# Altium schematic sheet 05_外部接口与其他部分.SchDoc
size A4
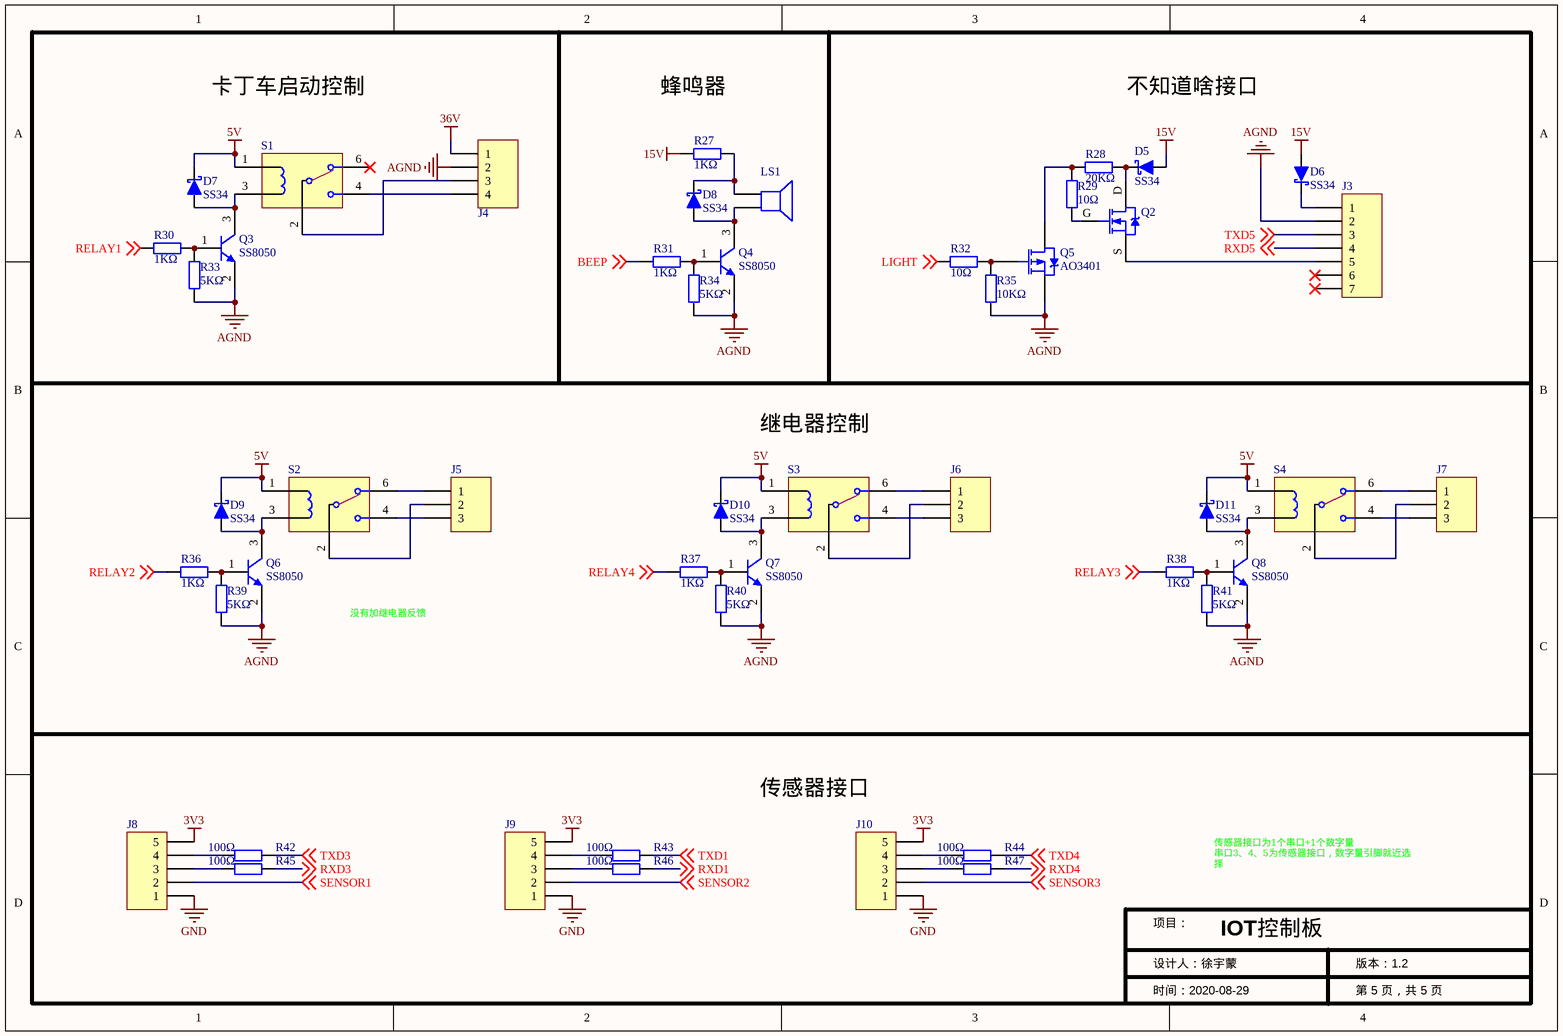
[diagram p0: 05_外部接口与其他部分.SchDoc]

## Parts
D5  SS34  [SMA(DO-214AC)]
D6  SS34  [SMA(DO-214AC)]
D7  SS34  [SMA(DO-214AC)]
D8  SS34  [SMA(DO-214AC)]
D9  SS34  [SMA(DO-214AC)]
D10  SS34  [SMA(DO-214AC)]
D11  SS34  [SMA(DO-214AC)]
J3  Header7  [Header_7X1_XH_2.54_弯针]  (value not drawn)
J4  Header 4  [Header_4P_XH_2.54_弯脚]  (value not drawn)
J5  Header3  [Header_3X1_XH_2.54_弯脚]  (value not drawn)
J6  Header3  [Header_3X1_XH_2.54_弯脚]  (value not drawn)
J7  Header3  [Header_3X1_XH_2.54_弯脚]  (value not drawn)
J8  Header5  [Header_5X1_XH_2.54_弯针]  (value not drawn)
J9  Header5  [Header_5X1_XH_2.54_弯针]  (value not drawn)
J10  Header5  [Header_5X1_XH_2.54_弯针]  (value not drawn)
LS1  蜂鸣器  [蜂鸣器 9*5mm]  (value not drawn)
Q2  AO3400  [SOT-23-MOSFET]  (value not drawn)
Q3  SS8050  [SOT-23]
Q4  SS8050  [SOT-23]
Q5  AO3401  [SOT-23-MOSFET]
Q6  SS8050  [SOT-23]
Q7  SS8050  [SOT-23]
Q8  SS8050  [SOT-23]
R27  value 1KΩ  [0603]  (hidden comment: Res)
R28  value 20KΩ  [0603]  (hidden comment: Res)
R29  value 10Ω  [0603]  (hidden comment: Res)
R30  value 1KΩ  [0603]  (hidden comment: Res)
R31  value 1KΩ  [0603]  (hidden comment: Res)
R32  value 10Ω  [0603]  (hidden comment: Res)
R33  value 5KΩ  [0603]  (hidden comment: Res)
R34  value 5KΩ  [0603]  (hidden comment: Res)
R35  value 10KΩ  [0603]  (hidden comment: Res)
R36  value 1KΩ  [0603]  (hidden comment: Res)
R37  value 1KΩ  [0603]  (hidden comment: Res)
R38  value 1KΩ  [0603]  (hidden comment: Res)
R39  value 5KΩ  [0603]  (hidden comment: Res)
R40  value 5KΩ  [0603]  (hidden comment: Res)
R41  value 5KΩ  [0603]  (hidden comment: Res)
R42  value 100Ω  [0603]  (hidden comment: Res)
R43  value 100Ω  [0603]  (hidden comment: Res)
R44  value 100Ω  [0603]  (hidden comment: Res)
R45  value 100Ω  [0603]  (hidden comment: Res)
R46  value 100Ω  [0603]  (hidden comment: Res)
R47  value 100Ω  [0603]  (hidden comment: Res)
S1  Delay  [SongLe_Relay]  (value not drawn)
S2  Delay  [SongLe_Relay]  (value not drawn)
S3  Delay  [SongLe_Relay]  (value not drawn)
S4  Delay  [SongLe_Relay]  (value not drawn)

## Nets
3V3: J8.5 J9.5 J10.5
5V: D7.2(K) D9.2(K) D10.2(K) D11.2(K) S1.1 S2.1 S3.1 S4.1
15V: D5.1(A) D6.1(A) R27.2
36V: J4.1
AGND: J3.2 J4.2 Q3.2(E) Q4.2(E) Q5.S Q6.2(E) Q7.2(E) Q8.2(E) R33.1 R34.1 R35.1 R39.1 R40.1 R41.1
GND: J8.1 J9.1 J10.1
BEEP: R31.2 ; off-sheet BEEP
LIGHT: R32.2 ; off-sheet LIGHT
RELAY1: R30.2 ; off-sheet RELAY1
RELAY2: R36.2 ; off-sheet RELAY2
RELAY3: R38.2 ; off-sheet RELAY3
RELAY4: R37.2 ; off-sheet RELAY4
RXD1: R46.2 ; off-sheet RXD1
RXD3: R45.2 ; off-sheet RXD3
RXD4: R47.2 ; off-sheet RXD4
RXD5: J3.4 ; off-sheet RXD5
SENSOR1: J8.2 ; off-sheet SENSOR1
SENSOR2: J9.2 ; off-sheet SENSOR2
SENSOR3: J10.2 ; off-sheet SENSOR3
TXD1: R43.2 ; off-sheet TXD1
TXD3: R42.2 ; off-sheet TXD3
TXD4: R44.2 ; off-sheet TXD4
TXD5: J3.3 ; off-sheet TXD5
NetD5_2: D5.2(K) Q2.D R28.1
NetD6_2: D6.2(K) J3.1
NetD7_1: D7.1(A) Q3.3(C) S1.3
NetD8_1: D8.1(A) LS1.2 Q4.3(C)
NetD8_2: D8.2(K) LS1.1 R27.1
NetD9_1: D9.1(A) Q6.3(C) S2.3
NetD10_1: D10.1(A) Q7.3(C) S3.3
NetD11_1: D11.1(A) Q8.3(C) S4.3
NetJ3_5: J3.5 Q2.S
NetJ4_3: J4.3 S1.2
NetJ4_4: J4.4 S1.4
NetJ5_1: J5.1 S2.6
NetJ5_2: J5.2 S2.2
NetJ5_3: J5.3 S2.4
NetJ6_1: J6.1 S3.6
NetJ6_2: J6.2 S3.2
NetJ6_3: J6.3 S3.4
NetJ7_1: J7.1 S4.6
NetJ7_2: J7.2 S4.2
NetJ7_3: J7.3 S4.4
NetJ8_3: J8.3 R45.1
NetJ8_4: J8.4 R42.1
NetJ9_3: J9.3 R46.1
NetJ9_4: J9.4 R43.1
NetJ10_3: J10.3 R47.1
NetJ10_4: J10.4 R44.1
NetQ2_G: Q2.G R29.2
NetQ3_1: Q3.1(B) R30.1 R33.2
NetQ4_1: Q4.1(B) R31.1 R34.2
NetQ5_D: Q5.D R28.2 R29.1
NetQ5_G: Q5.G R32.1 R35.2
NetQ6_1: Q6.1(B) R36.1 R39.2
NetQ7_1: Q7.1(B) R37.1 R40.2
NetQ8_1: Q8.1(B) R38.1 R41.2

Not connected (* = marked no-connect by the designer): J3 6* 7*; S1 6*

## Notes on the sheet
- 卡丁车启动控制
- 蜂鸣器
- 不知道啥接口
- 继电器控制
- 没有加继电器反馈
- 传感器接口
- 项目：
- 传感器接口为1个串口+1个数字量
  串口3、4、5为传感器接口，数字量引脚就近选择
- IOT控制板
- 设计人：徐宇蒙
- 时间：2020-08-29
- 第 5 页，共 5 页
- 版本：1.2

## Library data of the parts
D5-D11 = D Schottky: Schottky Diode; Published: 8-Jun-2000; LatestRevisionDate: 17-Jul-2002; LatestRevisionNote: Re-released for DXP Platform.; PackageReference: SMB; Publisher: Altium Limited; Code_JEDEC: DO-214-AA
J3 = Header7: 接插件
J4 = Header 4: 接插件; LatestRevisionDate: 17-Jul-2002; LatestRevisionNote: Re-released for DXP Platform.; Publisher: Altium Limited
J5-J7 = Header3: 接插件
J8-J10 = Header5: 接插件
LS1 = Speaker: Loudspeaker; Published: 24-Mar-1999; LatestRevisionDate: 17-Jul-2002; LatestRevisionNote: Re-released for DXP Platform.; Publisher: Altium Limited
Q2 = MOSFET-N: N沟道MOS管
Q3 Q4 Q6-Q8 = SS8050: NPN贴片三极管; Published: 8-Jun-2000; LatestRevisionDate: 15-Jan-2003; LatestRevisionNote: PCB Footprint 'BCY-W3/D4.7' replaced; DatasheetDocument: 1997; PackageDocument: Sep-1998; PackageReference: TO-92A; Publisher: Altium Limited; Code_JEDEC: TO-92A; ComponentLink1Description: Manufacturer Link; ComponentLink1URL: http://www.fairchildsemi.com/; ComponentLink2Description: Datasheet; ComponentLink2URL: http://www.fairchildsemi.com/ds/2N%2F2N3904.pdf
Q5 = MOSFET-P: P沟道MOS管
R27-R47 = Res: 贴片电阻; Published: 8-Jun-2000; LatestRevisionDate: 17-Jul-2002; LatestRevisionNote: Re-released for DXP Platform.; PackageReference: AXIAL-0.4; Publisher: Altium Limited
S1-S4 = SongLe_Relay: 松乐继电器